# EasyEDA Pro project esp8266_for_led.eprj

# Schematic 懒人关灯
Board Name: Board1; Create Date: 2025-05-22; Page Name: P1; Project Name: esp8266_for_led; Schematic Name: 懒人关灯; Update Date: 2025-05-25; Company: 嘉立创EDA; Page Size: A4; Version: V1.0
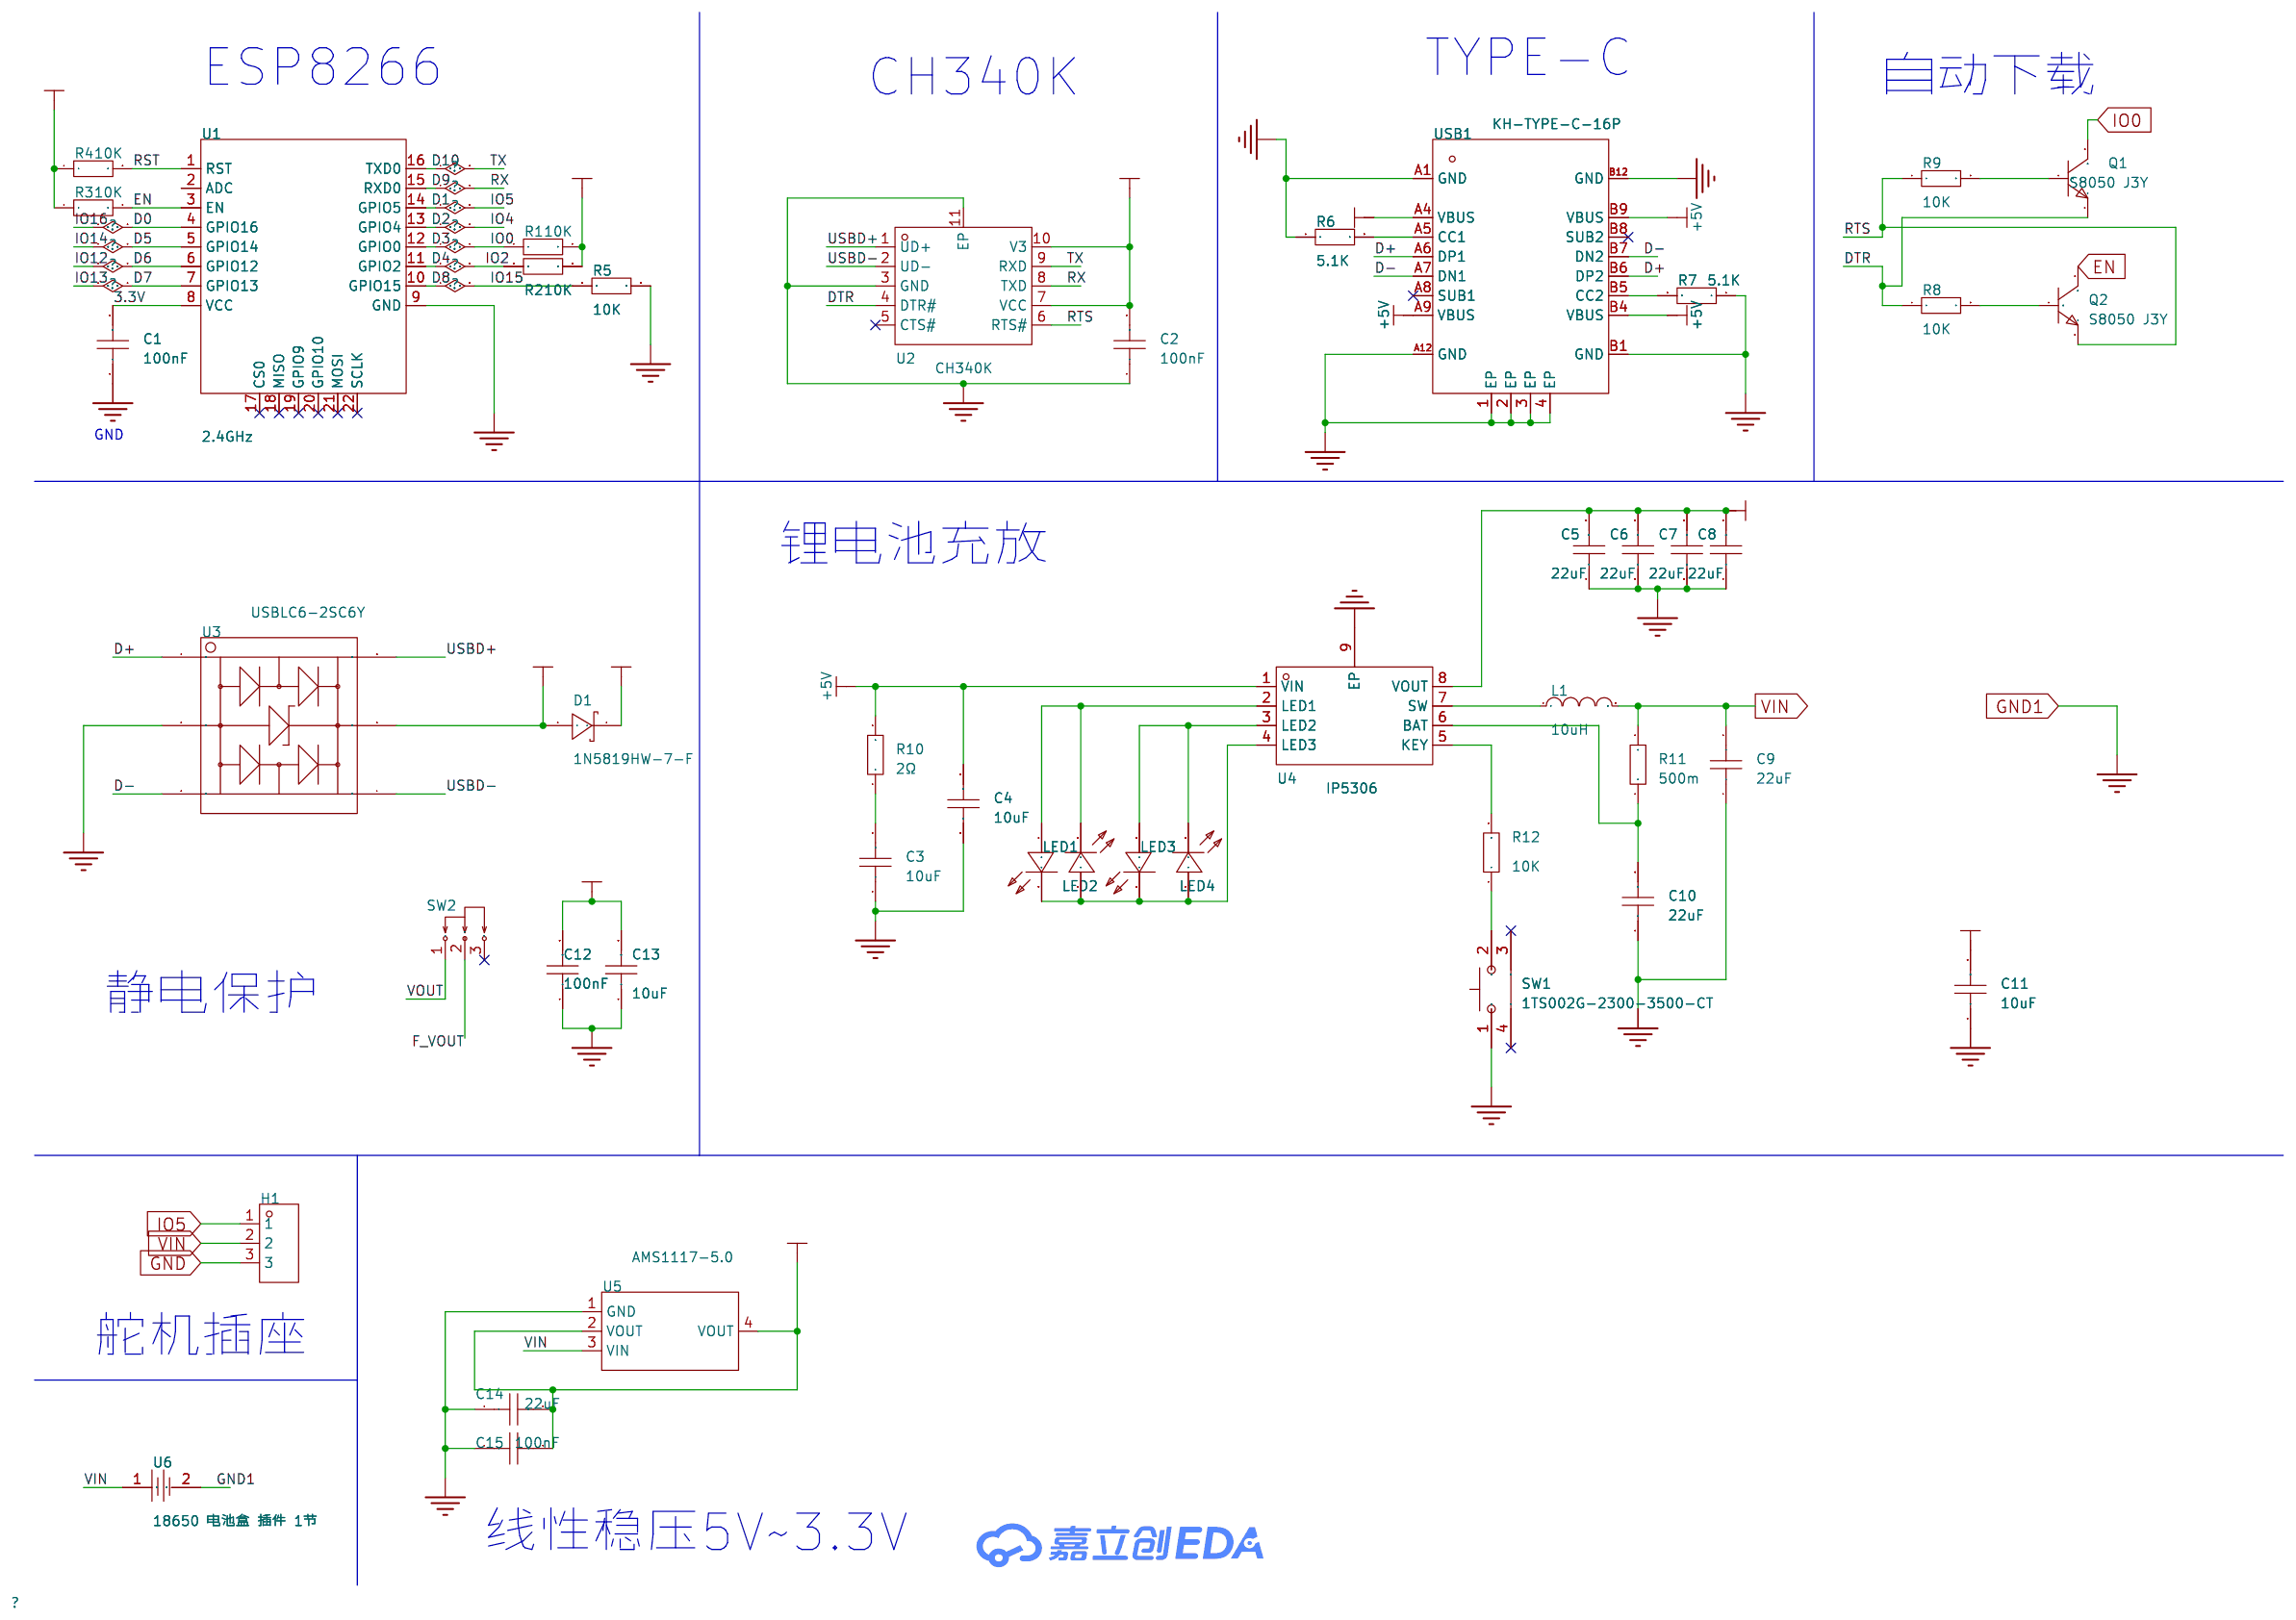
[diagram p0: schematic sheet]

## Parts
C1  100nF  [C0603]
C2  100nF  [C0603]
C3  10uF  [C0603]
C4  10uF  [C0603]
C5  22uF  [C0603]
C6  22uF  [C0603]
C7  22uF  [C0603]
C8  22uF  [C0603]
C9  22uF  [C0603]
C10  22uF  [C0603]
C11  10uF  [C0603]
C12  100nF  [C0603]
C13  10uF  [C0603]
C14  22uF  [C0603]
C15  100nF  [C0603]
D1  1N5819HW-7-F  [SOD-123_L2.7-W1.6-LS3.7-RD]
H1  PZ254V-11-03P-YL  [HDR-TH_PZ254V-11-03P-YL]
L1  10uH  [L0603]
LED1  KT-0805G  [LED0805-R-RD]
LED2  KT-0805G  [LED0805-R-RD]
LED3  KT-0805G  [LED0805-R-RD]
LED4  KT-0805G  [LED0805-R-RD]
Q1  S8050 J3Y  [SOT-23-3_L3.0-W1.7-P0.95-LS2.9-BR]
Q2  S8050 J3Y  [SOT-23-3_L3.0-W1.7-P0.95-LS2.9-BR]
R1  10K  [R0603]
R2  10K  [R0603]
R3  10K  [R0603]
R4  10K  [R0603]
R5  10K  [R0603]
R6  5.1K  [R0603]
R7  5.1K  [R0603]
R8  10K  [R0603]
R9  10K  [R0603]
R10  2Ω  [R0603]
R11  500m  [R0603]
R12  10K  [R0603]
SW1  1TS002G-2300-3500-CT  [KEY-SMD_1TS002G]
SW2  SS12D10G4 071  [SW-TH_SHOU-HAN_SS12D10G4]
U1  2.4GHz  [WIFIM-SMD_ESP-12F-ESP8266MOD]
U2  CH340K  [ESOP-10_L4.9-W3.9-P1.00-LS6.2-BL-EP]
U3  USBLC6-2SC6Y  [SOT-23-6_L2.9-W1.6-P0.95-LS2.8-BL]
U4  IP5306  [ESOP-8_L4.9-W3.9-P1.27-LS6.0-BL-EP]
U5  AMS1117-5.0  [SOT-223_L6.5-W3.5-P2.30-LS7.0-BR]
U6  18650 电池盒 插件 1节  [BAT-TH_18650-C9900004923]
USB1  KH-TYPE-C-16P  [USB-C-SMD_KH-TYPE-C-16P]

## Library data of the parts
C1-C15 = CAP_0603: Supplier Footprint: 0603
D1 = 1N5819HW-7-F: LCSC Part Name: 电压:40V 电流:1A; Supplier Part: C82544; Manufacturer: DIODES(美台); Supplier Footprint: SOD-123; JLCPCB Part Class: 扩展库; Datasheet: https://atta.szlcsc.com/upload/public/pdf/source/20161024/1477288459223.pdf; Supplier: LCSC; Forward Voltage (Vf@If): 450mV@1A; Reverse Voltage (Vr): 40V; Rectified Current: 1A; Reverse Leakage Current (Ir): 1mA@40V
H1 = PZ254V-11-03P-YL: Supplier Part: C41425306; Manufacturer: XFCN(兴飞); Supplier Footprint: 插件,P=2.54mm; JLCPCB Part Class: 扩展库; Datasheet: https://atta.szlcsc.com/upload/public/pdf/source/20241009/C227763597A5D58F5275B212435FDB0D.pdf; Supplier: LCSC
L1 = L_0603
LED1-LED4 = KT-0805G: LCSC Part Name: 0805 翠绿 高亮; Supplier Part: C2297; Manufacturer: KENTO; Supplier Footprint: 0805; JLCPCB Part Class: 基础库; Datasheet: https://atta.szlcsc.com/upload/public/pdf/source/20170209/1486607340485.pdf; Supplier: LCSC; Emitted Color: 翠绿色
Q1 Q2 = S8050 J3Y(RANGE:200-350): LCSC Part Name: H档(200-350); Supplier Part: C2146; Manufacturer: CJ(江苏长电/长晶); Supplier Footprint: SOT-23; JLCPCB Part Class: 基础库; Datasheet: https://atta.szlcsc.com/upload/public/pdf/source/20231013/FF37B6A000E6CDA75C9C999D2E78731F.pdf; Supplier: LCSC; type: NPN; Current - Collector(Ic): 500mA; Collector - Emitter Voltage VCEO: 25V; Pd - Power Dissipation: 300mW; DC Current Gain: 200@500mA,1V; Transition frequency(fT): 150MHz; Current - Collector Cutoff: 100nA; Vce Saturation(VCE(sat)): 600mV; Operating Temperature: -55℃~+150℃
R1-R12 = Res_0603: Supplier Footprint: 0603
SW1 = 1TS002G-2300-3500-CT: LCSC Part Name: 7.6*3.5*3.5mm 卧贴 轻触开关; Supplier Part: C319377; Manufacturer: HYP(鸿源精密); Supplier Footprint: SMD,3.5x7.6mm; JLCPCB Part Class: 扩展库; Datasheet: https://atta.szlcsc.com/upload/public/pdf/source/20181106/C319377_FDC1FB9730904BE1C6DB205F4DA5523F.pdf; Supplier: LCSC; Circuit: 单刀单掷; Actuator Style: 矩形按钮; Operating Force: 230gf; Mounting Style: 卧贴; Switch Length: 7.6mm; Switch Width: 3.5mm; Switch Height: 3.5mm; Strike Gundam: 不带; Contact Current: 50mA; Voltage Rating (DC): 12V; Power Rating: 0.6W; Insulation Resistance: 100MΩ; Actuator/Cap Color: 黑色; With Lamp: 无; Pin Style: J型引脚; Mechanical Life: 3万次; Operating Temperature: -40℃~+90℃
SW2 = SS12D10G4 071: Supplier Part: C2887259; Manufacturer: SHOU HAN(首韩); Supplier Footprint: 插件; JLCPCB Part Class: 扩展库; Datasheet: https://atta.szlcsc.com/upload/public/pdf/source/20210820/80D1704BBF3FCEE0435FCAA54C61E0A3.pdf; Supplier: LCSC; Circuit: 单刀双掷; Pin Style: PC引脚; Switch Length: 12.7mm; Switch Width: 6.7mm; Switch Height: 6.4mm; Mounting Style: 直插; Current Rating (DC): 2A; Voltage Rating (DC): 125V; Mechanical Life: 3千次; Operating Temperature: -16℃~+60℃
U1 = ESP-12F(ESP8266MOD): LCSC Part Name: 完整的802.11b/g/nWi-FiSoC模块 屏蔽罩上的丝印是：ESP8266MOD，ESP8266EX串口WIFI; Supplier Part: C82891; Manufacturer: Ai-Thinker(安信可); Supplier Footprint: SMD,16x24mm; JLCPCB Part Class: 扩展库; Datasheet: https://atta.szlcsc.com/upload/public/pdf/source/20210219/C82891_ABD84A460F4F056A2757267CCCA4B508.pdf; Supplier: LCSC; Core Processor: ESP8266芯片; Support Interface: GPIO；UART；I2C；PWM；SPI；ADC; Antenna Type: 板载PCB天线; Output Power: 16dBm; Operating Voltage: 3.3V; Receive  Current: 120mA; Send  Current: 170mA; Sensitivity: -90dBm; Operating Temperature: -40℃~+85℃
U2 = CH340K: LCSC Part Name: USB转串口芯片CH340; Supplier Part: C968586; Manufacturer: WCH(南京沁恒); Supplier Footprint: ESSOP-10-150mil-1mm; JLCPCB Part Class: 扩展库; Datasheet: https://atta.szlcsc.com/upload/public/pdf/source/20240313/C21A12AB66F63ABF8F8743FF13A35C95.pdf; Supplier: LCSC; Applications Function: USB转串口; Protocol: USB 2.0; Voltage - Supply: 3.3V；5V; Data Rate: 2Mbps; Operating Temperature: -20℃~+70℃
U3 = USBLC6-2SC6Y: Supplier Part: C5310974; Manufacturer: TECH PUBLIC(台舟); Supplier Footprint: SOT-23-6; JLCPCB Part Class: 扩展库; Datasheet: https://atta.szlcsc.com/upload/public/pdf/source/20221212/069345D45678B0F27086425C11086B50.pdf; Supplier: LCSC
U4 = IP5306: Supplier Part: C181692; Manufacturer: INJOINIC(英集芯); Supplier Footprint: ESOP-8; JLCPCB Part Class: 扩展库; Datasheet: https://atta.szlcsc.com/upload/public/pdf/source/20190627/C384572_9925B3DDC4041BC6108E5AB46A2A0AB1.pdf; Supplier: LCSC
U5 = AMS1117-5.0_C6187: LCSC Part Name: 输入12V 输出5V 1A; Supplier Part: C6187; Manufacturer: AMS; Supplier Footprint: SOT-223; JLCPCB Part Class: 基础库; Datasheet: https://atta.szlcsc.com/upload/public/pdf/source/20230918/E4B716057EE82179D88E8A0894830D59.pdf; Supplier: LCSC; Output Type: 固定; Voltage - Supply: 12V; Output Voltage: 5V; Output Current: 1A; Voltage Dropout: 1.3V@(1A); Features: 过流保护(OCP); Output Configuration: 正极; Number of Outputs: 1
U6 = 18650 电池盒 插件 1节: Supplier Part: C9900004923; Supplier Footprint: BAT_TH_2P-L77.7-W20.9-P55.61; JLCPCB Part Class: 扩展库; Supplier: LCSC
USB1 = KH-TYPE-C-16P: LCSC Part Name: Type-C 母 卧贴; Supplier Part: C709357; Manufacturer: kinghelm(金航标); Supplier Footprint: SMD; JLCPCB Part Class: 扩展库; Datasheet: https://atta.szlcsc.com/upload/public/pdf/source/20200911/C709357_AA8DCEB38BB20E3035A7ED7AE7667837.pdf; Supplier: LCSC; Connector Type: Type-C; Gender: 母; Number of Ports: 1; Number of Contacts: 16P; Mounting Style: 卧贴; Current Rating - Power (Max): 3A; Operating Temperature Range: -40℃~+85℃

## Nets
3.3V: C1.2 U1.8(VCC)
+3.3V: C2.2 C14.2 C15.2 R1.2 R2.2 R3.1 R4.1 U2.7(VCC) U2.10(V3) U5.2(VOUT) U5.4(VOUT)
+5V: C4.2 R10.2 U4.1(VIN) USB1.A4(VBUS) USB1.A9(VBUS) USB1.B4(VBUS) USB1.B9(VBUS)
GND: C1.1 C2.1 C3.1 C4.1 C5.1 C6.1 C7.1 C8.1 C9.1 C10.1 C11.1 C12.1 C13.1 C14.1 C15.1 H1.3 R5.2 R6.1 R7.1 SW1.1 U1.9(GND) U2.3(GND) U2.11(EP) U3.2(GND) U4.9(EP) U5.1(GND) USB1.1(EP) USB1.2(EP) USB1.3(EP) USB1.4(EP) USB1.A1(GND) USB1.A12(GND) USB1.B1(GND) USB1.B12(GND)
GND1: U6.2
VIN: C9.2 C11.2 D1.1(K) H1.2 L1.2 R11.2 U5.3(VIN) U6.1
D0: U1.4(GPIO16)
D1: H1.1 U1.14(GPIO5)
D2: U1.13(GPIO4)
D3: Q1.3(C) R1.1 U1.12(GPIO0)
D4: R2.1 U1.11(GPIO2)
D5: U1.5(GPIO14)
D6: U1.6(GPIO12)
D7: U1.7(GPIO13)
D8: R5.1 U1.10(GPIO15)
D9: U1.15(RXD0) U2.8(TXD)
D10: U1.16(TXD0) U2.9(RXD)
D+: U3.1(I/O1) USB1.A6(DP1) USB1.B6(DP2)
D-: U3.3(I/O2) USB1.A7(DN1) USB1.B7(DN2)
DTR: Q1.2(E) R8.1 U2.4(DTR#)
EN: Q2.3(C) R3.2 U1.3(EN)
F_VOUT: C12.2 C13.2 D1.2(A) SW2.2 U3.5(VBUS)
RST: R4.2 U1.1(RST)
RTS: Q2.2(E) R9.1 U2.6(RTS#)
USBD+: U2.1(UD+) U3.6(I/O1)
USBD-: U2.2(UD-) U3.4(I/O2)
VOUT: C5.2 C6.2 C7.2 C8.2 SW2.1 U4.8(VOUT)
$1N1979: R6.2 USB1.A5(CC1)
$1N2301: R7.2 USB1.B5(CC2)
$1N2667: Q1.1(B) R9.2
$1N2978: Q2.1(B) R8.2
$1N3700: C3.2 R10.1
$1N4027: LED1.1(A) LED2.2(K) U4.2(LED1)
$1N4045: LED3.1(A) LED4.2(K) U4.3(LED2)
$1N4060: LED1.2(K) LED2.1(A) LED3.2(K) LED4.1(A) U4.4(LED3)
$1N4374: L1.1 U4.7(SW)
$1N4651: C10.2 R11.1 U4.6(BAT)
$1N4760: R12.2 U4.5(KEY)
$1N4967: R12.1 SW1.2

Not connected (* = marked no-connect by the designer): SW1 3* 4*; SW2 3*; U1 2(ADC) 17(CS0)* 18(MISO)* 19(GPIO9)* 20(GPIO10)* 21(MOSI)* 22(SCLK)*; U2 5(CTS#)*; USB1 A8(SUB1)* B8(SUB2)*

## Notes on the sheet
- ESP8266
- TYPE-C
- CH340K
- 自动下载
- GND
- 锂电池充放
- 静电保护
- 舵机插座
- 线性稳压5V~3.3V

# Board PCB1
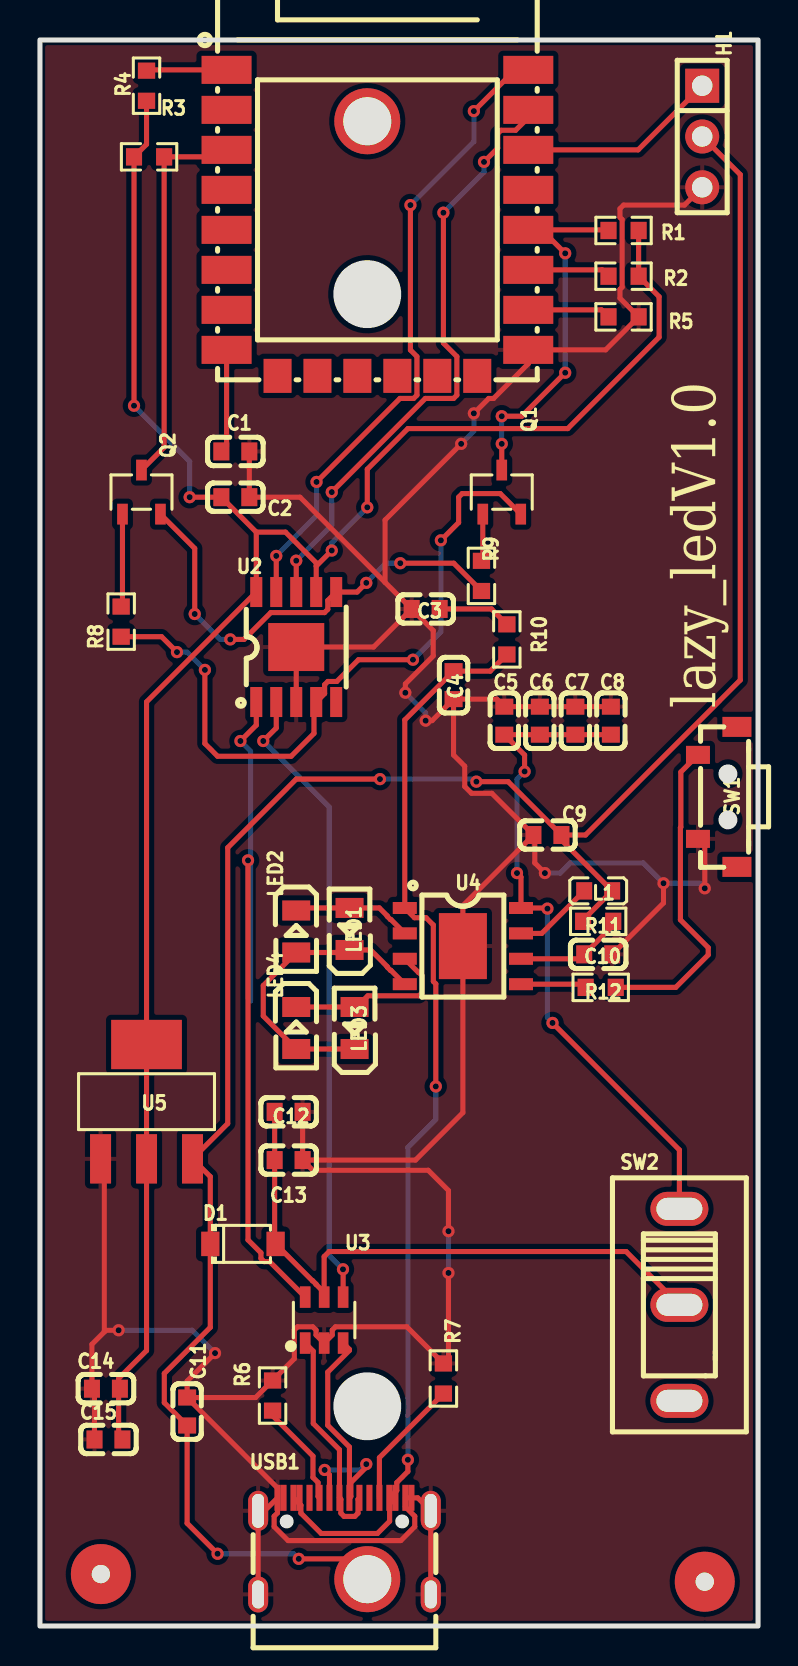
[diagram p1: board, top side]
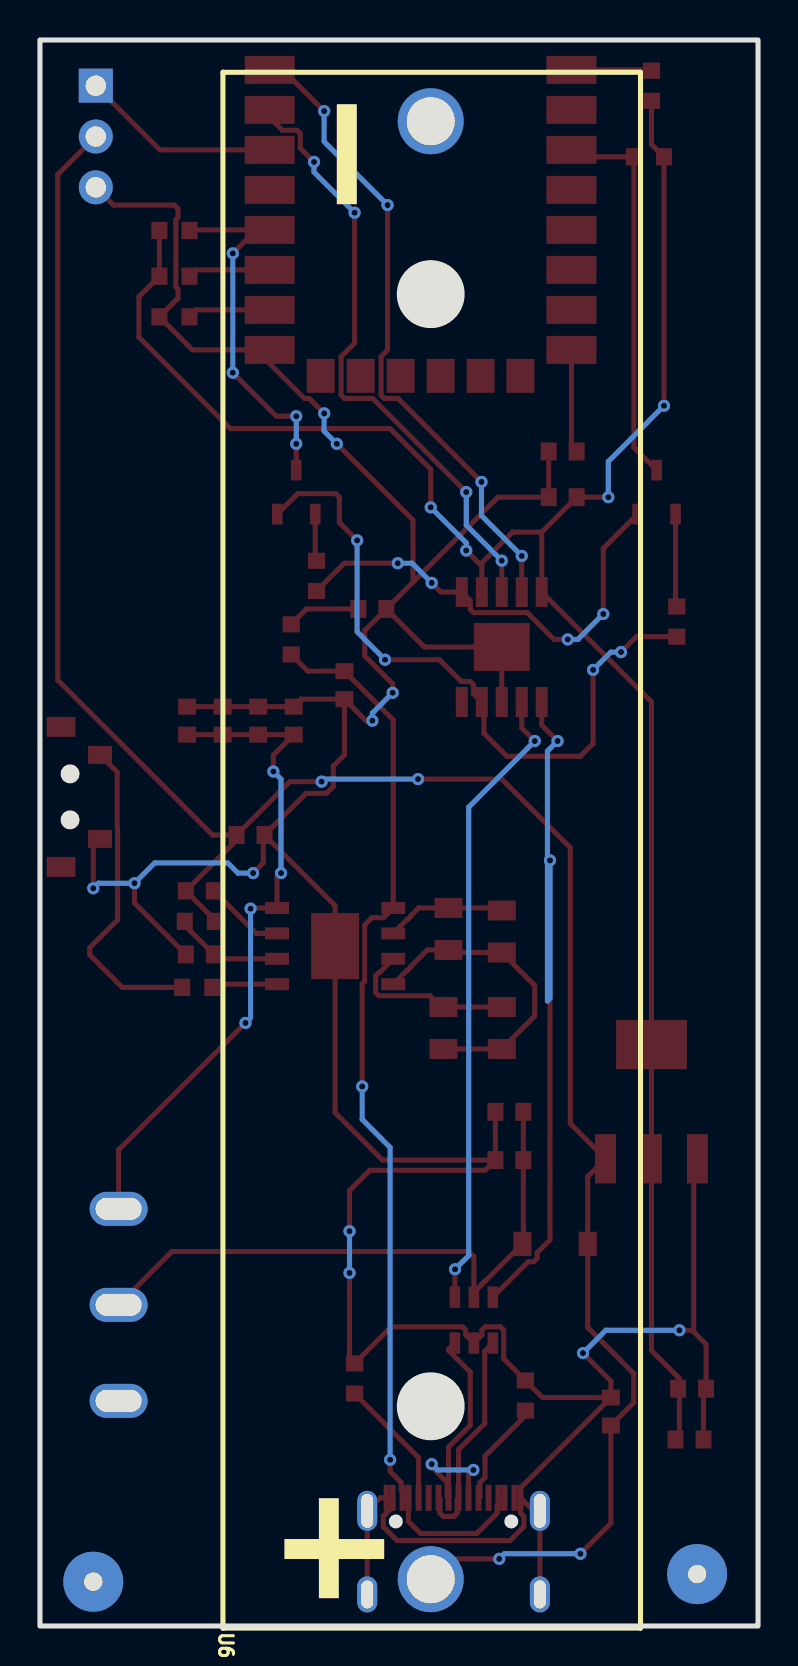
[diagram p2: board, bottom side, seen from below]

Outline 35.94 x 79.3 mm; copper layers: Top Layer, Bottom Layer. Coordinates in mm from the lower left corner of the outline.
Outline path: rectangle 0,79.3 35.94,0
Stack: Top Layer 0.035mm / Dielectric1 1.51mm FR4 er 4.5 / Bottom Layer 0.035mm

## Design rules (mm)
template: JLCPCB Capability(Two Layers Board)
spacing copperThickness1oz (default): track to track 0.102, other pairs 0.152 to 0.3
spacing copperThickness2oz: track to track 0.203, other pairs 0.152 to 0.3
track width copperThickness1oz (default): min 0.127, default 0.254, max 2.54
track width copperThickness2oz: min 0.203, default 0.254, max 2.54
differential pair differentialPair (default): width min 0.127, default 0.254, max 2.54; gap min 0.152, default 0.152
via viaSize (default): diameter min 0.5, default 0.61, max 10; hole min 0.3, default 0.305, max 6.3

## Placement (name value [footprint] x y rotation side)
C1  100nF  [C0603]  9.78 58.73 180 top
C2  100nF  [C0603]  9.78 56.44 180 top
C3  10uF  [C0603]  19.3 50.86 0 top
C4  10uF  [C0603]  20.7 47.05 90 top
C5  22uF  [C0603]  23.24 45.27 270 top
C6  22uF  [C0603]  25.02 45.27 270 top
C7  22uF  [C0603]  26.8 45.27 270 top
C8  22uF  [C0603]  28.57 45.27 270 top
C9  22uF  [C0603]  25.4 39.55 0 top
C10  22uF  [C0603]  27.94 33.58 180 top
C11  10uF  [C0603]  7.37 10.72 270 top
C12  100nF  [C0603]  12.45 25.71 180 top
C13  10uF  [C0603]  12.45 23.3 180 top
C14  22uF  [C0603]  3.3 11.87 0 top
C15  100nF  [C0603]  3.43 9.33 0 top
D1  1N5819HW-7-F  [SOD-123_L2.7-W1.6-LS3.7-RD]  10.16 19.11 0 top
H1  PZ254V-11-03P-YL  [HDR-TH_PZ254V-11-03P-YL]  33.15 74.48 270 top
L1  10uH  [L0603]  27.94 36.76 0 top
LED1  KT-0805G  [LED0805-R-RD]  15.49 34.85 90 top
LED2  KT-0805G  [LED0805-R-RD]  12.83 34.73 270 top
LED3  KT-0805G  [LED0805-R-RD]  15.75 29.9 90 top
LED4  KT-0805G  [LED0805-R-RD]  12.83 29.9 270 top
NOREF  -  [Pad_e45]  33.27 2.22 0 top
NOREF#2  -  [Pad_e47]  3.05 2.6 0 top
Q1  S8050 J3Y  [SOT-23-3_L3.0-W1.7-P0.95-LS2.9-BR]  23.11 56.7 270 top
Q2  S8050 J3Y  [SOT-23-3_L3.0-W1.7-P0.95-LS2.9-BR]  5.08 56.7 270 top
R1  10K  [R0603]  29.21 69.78 0 top
R2  10K  [R0603]  29.21 67.49 0 top
R3  10K  [R0603]  5.46 73.46 0 top
R4  10K  [R0603]  5.33 77.02 90 top
R5  10K  [R0603]  29.21 65.46 0 top
R6  5.1K  [R0603]  11.64 11.52 270 top
R7  5.1K  [R0603]  20.19 12.38 270 top
R8  10K  [R0603]  4.06 50.22 90 top
R9  10K  [R0603]  22.1 52.51 90 top
R10  2Ω  [R0603]  23.37 49.33 270 top
R11  500m  [R0603]  27.94 35.23 180 top
R12  10K  [R0603]  28.07 31.93 180 top
SW1  1TS002G-2300-3500-CT  [KEY-SMD_1TS002G]  33.91 41.46 90 top
SW2  SS12D10G4 071  [SW-TH_SHOU-HAN_SS12D10G4]  32 16.06 270 top
U1  2.4GHz  [WIFIM-SMD_ESP-12F-ESP8266MOD]  16.89 70.16 270 top
U2  CH340K  [ESOP-10_L4.9-W3.9-P1.00-LS6.2-BL-EP]  12.83 48.95 0 top
U3  USBLC6-2SC6Y  [SOT-23-6_L2.9-W1.6-P0.95-LS2.8-BL]  14.22 15.3 0 top
U4  IP5306  [ESOP-8_L4.9-W3.9-P1.27-LS6.0-BL-EP]  21.17 34 270 top
U5  AMS1117-5.0  [SOT-223_L6.5-W3.5-P2.30-LS7.0-BR]  5.33 26.22 270 top
U6  18650 电池盒 插件 1节  [BAT-TH_18650-C9900004923]  16.38 38.79 90 bottom
USB1  KH-TYPE-C-16P  [USB-C-SMD_KH-TYPE-C-16P]  15.24 3.99 0 top

## Footprints (pads in the part's own frame, mm; a bottom-side part is the same pattern mirrored in y, then rotated)
BAT-TH_18650-C9900004923
  round 3.3 hole 2.4: 1(-36.45,0) 2(36.45,0)
C0603
  rect 0.8x0.9 smd: 1(-0.7,0) 2(0.7,0)
ESOP-8_L4.9-W3.9-P1.27-LS6.0-BL-EP
  rect 0.6x1.2 smd: 1(-1.905,-2.909) 2(-0.635,-2.909) 3(0.635,-2.909) 4(1.905,-2.909) 5(1.905,2.909) 6(0.635,2.909) 7(-0.635,2.909) 8(-1.905,2.909)
  rect 3.3x2.4 smd: 9(0,0)
ESOP-10_L4.9-W3.9-P1.00-LS6.2-BL-EP
  rect 0.6x1.5 smd: 1(-2,-2.75) 2(-1,-2.75) 3(0,-2.75) 4(1,-2.75) 5(2,-2.75) 6(2,2.75) 7(1,2.75) 8(0,2.75) 9(-1,2.75) 10(-2,2.75)
  rect 2.8x2.4 smd: 11(0,0)
HDR-TH_PZ254V-11-03P-YL
  rect 1.7x1.7 hole 1.02: 1(-2.54,0)
  round 1.7 hole 1.02: 2(0,0) 3(2.54,0)
KEY-SMD_1TS002G
  rect 0.9x1.2 smd: 1(-2.1,0.975) 2(2.1,0.975)
  rect 1x1.45 smd: 3(3.5,-0.975) 4(-3.5,-0.975)
L0603
  rect 0.8x0.864 smd: 1(-0.7,0) 2(0.7,0)
LED0805-R-RD
  rect 1x1.399 smd: 1(1.05,0) 2(-1.05,0)
Pad_e45
  round 3 hole 0.914: 1(0,0)
Pad_e47
  round 3 hole 0.914: 1(0,0)
R0603
  rect 0.806x0.864 smd: 1(-0.753,0) 2(0.753,0)
SOD-123_L2.7-W1.6-LS3.7-RD
  rect 0.91x1.22 smd: 1(-1.635,0) 2(1.635,0)
SOT-23-3_L3.0-W1.7-P0.95-LS2.9-BR
  rect 1.038x0.532 smd: 1(1.101,-0.95) 2(1.101,0.95) 3(-1.101,0)
SOT-23-6_L2.9-W1.6-P0.95-LS2.8-BL
  rect 0.532x1.072 smd: 1(-0.95,-1.149) 2(0,-1.149) 3(0.95,-1.149) 4(0.95,1.149) 5(0,1.149) 6(-0.95,1.149)
SOT-223_L6.5-W3.5-P2.30-LS7.0-BR
  rect 2.465x1.05 smd: 1(2.857,-2.3) 2(2.857,0) 3(2.857,2.3)
  rect 2.465x3.54 smd: 4(-2.857,0)
SW-TH_SHOU-HAN_SS12D10G4
  oval 1.7x2.9 hole 1.1x2.3: 1(-4.8,0) 2(0,0) 3(4.8,0)
USB-C-SMD_KH-TYPE-C-16P
  oval 1x2 hole 0.6x1.7: 1(-4.32,1.765) 2(4.32,1.765)
  oval 1x1.8 hole 0.6x1.4: 3(-4.32,-2.415) 4(4.32,-2.415)
  rect 0.3x1.3 smd: A1(-3.35,2.415) A4(-2.55,2.415) A5(-1.25,2.415) A6(-0.25,2.415) A7(0.25,2.415) A8(1.25,2.415) A9(2.55,2.415) A12(3.35,2.415) B1(3.05,2.415) B4(2.25,2.415) B5(1.75,2.415) B6(0.75,2.415) B7(-0.75,2.415) B8(-1.75,2.415) B9(-2.25,2.415) B12(-3.05,2.415)
WIFIM-SMD_ESP-12F-ESP8266MOD
  rect 1.4x2.5 smd: 1(-7.651,-7.551) 2(-5.651,-7.551) 3(-3.651,-7.551) 4(-1.651,-7.551) 5(0.349,-7.551) 6(2.349,-7.551) 7(4.349,-7.551) 8(6.349,-7.551) 9(6.349,7.548) 10(4.349,7.55) 11(2.349,7.551) 12(0.349,7.551) 13(-1.651,7.55) 14(-3.651,7.551) 15(-5.651,7.551) 16(-7.651,7.551)
  rect 1.7x1.4 smd: 17(7.651,-5) 18(7.649,-3.002) 19(7.649,-1.004) 20(7.649,0.998) 21(7.649,2.997) 22(7.651,4.997)

## Nets
As in the schematic.

Pads without a net: NOREF 1; NOREF#2 1; SW1 3 4; SW2 3; U1 2 17 18 19 20 21 22; U2 5; USB1 A8 B8

## Via types
v1: diameter 0.61, hole 0.305, Top Layer to Bottom Layer, 51 vias

## Routing (per net, layer and track width the routed paths; a pad name or vN(x,y) marks a point on that pad's centre or on a via; arc(x,y) is an arc through that point)
3.3V: length 5.2
  Top Layer w0.254: C1.2 9.34,58.99 U1.8
+3.3V: length 107.7
  Top Layer w0.254: v1(7.49,56.44) C2.2 10.83,54.7 ; 10.83,54.7 U2.10 5.33,46.21 U5.4 U5.2 5.33,13.77 3.94,12.38 3.94,9.52 C15.2 ; 10.83,54.7 12.29,54.7 13.83,53.16 13.83,53 ; U2.7 13.83,53 ; 13.83,53 v1(14.6,53.78) ; v1(16.38,55.94) 16.38,57.84 18.41,59.87 26.42,59.87 30.99,64.45 30.99,66.47 R2.2 R1.2 ; R4.1 5.33,74.09 R3.1 v1(4.71,61.02)
  Bottom Layer w0.254: v1(14.6,53.78) 14.6,54.16 v1(16.38,55.94) ; v1(4.71,61.02) 7.49,58.23 v1(7.49,56.44)
+5V: length 54.6
  Top Layer w0.254: 17.79,6.41 17.5,6.12 17.5,5.24 16.89,4.63 14.08,4.63 13.06,5.64 13.06,6.04 12.69,6.41 ; v1(19.81,26.98) 19.81,32.11 19.69,32.23 19.69,35.05 19.33,35.41 18.75,35.41 U4.1 18.26,45.31 C4.2 22.54,47.75 R10.2 ; 17.49,6.41 17.86,6.78 17.86,7.17 18.41,7.73 v1(18.41,8.31)
  Bottom Layer w0.254: v1(19.81,26.98) 19.81,25.33 18.41,23.93 v1(18.41,8.31)
GND: length 209.9
  Top Layer w0.254: C3.1 16.7,48.95 U2.11 U2.3 ; C3.1 19.69,49.78 19.69,48.51 18.29,47.11 v1(18.29,46.67) ; C3.1 17.27,52.19 ; v1(33.27,36.89) 33.27,39.02 SW1.1 ; 10.48,58.73 10.48,56.44 13.02,56.44 17.27,52.19 ; U5.1 3.22,23.18 3.22,14.7 ; v1(20.45,17.65) 20.45,13.38 R7.1 18.36,14.96 14.79,14.96 14.63,14.8 14.63,14.55 U3.2 13.82,14.55 13.82,14.8 13.66,14.96 12.89,14.96 12.73,14.8 12.73,13.36 R6.1 10.79,11.42 7.37,11.42 ; v1(20.45,19.74) 20.45,21.77 19.43,22.79 13.65,22.79 C13.1 ; 11.89,6.41 11.89,6.9 7.37,11.42 ; 11.89,6.41 11.24,5.76 USB1.1 USB1.3 ; 11.89,6.41 11.89,5.66 11.72,5.49 11.72,4.97 12.42,4.27 18.06,4.27 18.76,4.97 18.76,5.49 18.29,5.96 18.29,6.41 18.91,6.41 USB1.2 USB1.4 ; C9.1 24.76,39.49 24.76,38.16 v1(25.27,37.65) ; C9.1 21.17,36.02 U4.9 21.17,25.67 18.8,23.3 C13.1 ; C9.1 22.62,41.64 21.6,41.64 21.26,41.98 21.26,42.99 20.7,43.55 C4.1 ; v1(21.08,59.11) 17.27,55.3 17.27,52.19 ; v1(8.76,13.64) 7.37,12.25 7.37,11.42 ; C13.1 C12.1 ; C4.1 22.86,46.35 C5.1 C6.1 C7.1 C8.1 ; C4.1 19.62,45.27 v1(19.3,45.27) ; C10.1 31.21,36.15 v1(31.21,37.14) ; H1.3 32.26,71.05 29.21,71.05 29.03,70.87 29.03,70.44 29.14,70.33 29.14,66.95 29.03,66.84 29.03,66.39 R5.2 28.31,63.81 U1.9 24.44,63.12 22.7,61.38 22.46,61.38 v1(21.72,60.64) ; 3.22,14.7 2.6,14.09 C14.1 2.73,11.74 C15.1 ; 3.22,14.7 3.3,14.79 v1(3.94,14.79)
  Bottom Layer w0.254: v1(18.29,46.67) 19.3,45.65 v1(19.3,45.27) ; v1(21.72,60.64) 21.72,59.75 v1(21.08,59.11) ; v1(8.76,13.64) 7.62,14.79 v1(3.94,14.79) ; v1(20.45,19.74) v1(20.45,17.65) ; v1(33.27,36.89) 33.02,37.14 v1(31.21,37.14) 30.19,38.16 26.54,38.16 26.03,37.65 v1(25.27,37.65)
VIN: length 111.5
  Top Layer w0.254: R11.2 27.19,35.31 L1.2 26.1,39.3 C9.2 ; v1(8.89,3.61) 7.37,5.14 C11.2 6.22,11.17 6.22,12.63 8.53,14.93 D1.1 8.53,22.47 U5.3 9.4,25.12 9.4,38.92 12.83,42.35 v1(17.02,42.35) ; H1.2 35.05,72.57 35.05,47.3 27.31,39.55 C9.2 ; v1(12.95,3.36) 16.25,3.36 16.38,3.23 ; C9.2 23.43,42.22 v1(21.84,42.22)
  Bottom Layer w0.254: v1(17.02,42.35) 21.72,42.35 v1(21.84,42.22) ; v1(8.89,3.61) 12.7,3.61 v1(12.95,3.36)
D1: length 10
  Top Layer w0.254: 33.15,77.02 29.94,73.81 U1.14
D3: length 18.4
  Top Layer w0.254: v1(26.29,68.64) 25.11,69.81 ; 25.11,69.81 28.43,69.81 R1.1 ; 25.11,69.81 U1.12 ; Q1.3 v1(23.11,59.11) ; v1(23.11,60.49) 24.11,60.49 v1(26.29,62.67)
  Bottom Layer w0.254: v1(26.29,62.67) v1(26.29,68.64) ; v1(23.11,59.11) v1(23.11,60.49)
D4: length 4.1
  Top Layer w0.254: R2.1 28.14,67.81 U1.11
D8: length 4.2
  Top Layer w0.254: R5.1 28.11,65.81 U1.10
D9: length 30.7
  Top Layer w0.254: v1(22.22,73.21) 22.91,73.9 22.91,74.63 23.08,74.79 23.81,74.79 24.44,75.42 U1.15 ; v1(14.6,56.7) 19.29,61.38 20.7,61.38 20.87,61.55 20.87,63.48 20.19,64.15 v1(20.19,70.67) ; v1(12.83,53.27) U2.8
  Bottom Layer w0.254: v1(14.6,56.7) 14.6,55.05 v1(12.83,53.27) ; v1(20.19,70.67) 22.22,72.7 v1(22.22,73.21)
D10: length 32.4
  Top Layer w0.254: U1.16 23.78,77.81 v1(21.72,75.75) ; U2.9 v1(11.83,53.51) ; v1(18.54,71.05) 18.54,63.8 18.87,63.48 18.87,61.55 18.7,61.38 18.02,61.38 v1(13.84,57.21)
  Bottom Layer w0.254: v1(21.72,75.75) 21.72,74.22 v1(18.54,71.05) ; v1(11.83,53.51) 13.84,55.52 v1(13.84,57.21)
D+: length 11
  Top Layer w0.254: U3.1 13.68,13.74 13.68,10.13 14.99,8.81 14.99,6.41 15.06,6.34 15.06,5.64 15.22,5.48 15.76,5.48 15.92,5.64 15.92,6.34 15.99,6.41
D-: length 14.5
  Top Layer w0.254: U3.3 15.49,13.83 15.49,13.78 14.4,12.7 14.4,10.04 15.49,8.95 15.49,6.41 15.56,6.48 15.56,7.17 16.33,7.95 v1(16.33,8.09) ; 14.49,6.41 14.49,7.56 v1(14.25,7.8)
  Bottom Layer w0.254: v1(16.33,8.09) 16.04,7.8 v1(14.25,7.8)
DTR: length 35
  Top Layer w0.254: v1(8.25,47.81) 8.25,44.12 8.89,43.49 12.57,43.49 13.72,44.63 13.72,46.09 U2.4 14.25,46.62 14.25,47.07 14.41,47.23 14.86,47.23 15.94,48.32 v1(18.67,48.32) ; v1(20.07,54.28) 20.96,55.17 20.96,56.44 21.13,56.62 23.04,56.62 Q1.2 ; v1(6.86,48.7) 6.09,49.47 R8.1
  Bottom Layer w0.254: v1(20.07,54.28) 20.07,49.71 v1(18.67,48.32) ; v1(8.25,47.81) 7.37,48.7 v1(6.86,48.7)
EN: length 19.4
  Top Layer w0.254: Q2.3 6.21,58.93 R3.2 8.99,73.46 U1.3
F_VOUT: length 31.1
  Top Layer w0.254: SW2.2 29.34,18.73 14.48,18.73 14.22,18.47 14.22,16.68 ; 14.22,16.68 13.82,17.08 13.82,17.1 13.66,17.26 13.64,17.26 D1.2 11.75,19.16 C13.2 C12.2 ; 14.22,16.68 U3.5
RST: length 4
  Top Layer w0.254: U1.1 5.37,77.81 R4.2
RTS: length 23
  Top Layer w0.254: v1(18.03,53.14) 20.71,53.14 R9.1 ; v1(16.33,52.16) 15.87,51.7 U2.6 14.41,51.28 14.41,50.84 14.24,50.67 11.55,50.67 10.21,49.33 v1(9.53,49.33) ; Q2.2 7.75,53.88 v1(7.75,50.6)
  Bottom Layer w0.254: v1(18.03,53.14) 17.32,53.14 v1(16.33,52.16) ; v1(7.75,50.6) 9.02,49.33 v1(9.53,49.33)
USBD+: length 45.8
  Top Layer w0.254: U2.1 10.83,45.05 v1(10.03,44.25) ; v1(10.41,38.28) 10.41,19.31 11.06,18.66 11.06,18.38 11.22,18.22 11.5,18.22 U3.6
  Bottom Layer w0.254: v1(10.03,44.25) 10.54,43.74 10.54,31.25 10.41,31.38 v1(10.41,38.28)
USBD-: length 31.7
  Top Layer w0.254: v1(11.18,44.25) 11.83,44.9 U2.2 ; U3.4 15.17,17.83 v1(15.17,17.84)
  Bottom Layer w0.254: v1(15.17,17.84) 14.48,18.53 14.48,40.95 v1(11.18,44.25)
VOUT: length 33.7
  Top Layer w0.254: v1(23.88,37.65) 24.08,37.45 U4.8 25.37,35.9 v1(25.4,35.87) ; v1(25.65,30.16) 32,23.81 SW2.1 ; v1(24.26,42.73) 24.26,43.55 C5.2 C6.2 C7.2 C8.2
  Bottom Layer w0.254: v1(24.26,42.73) 23.88,42.35 v1(23.88,37.65) ; v1(25.65,30.16) 25.4,30.41 v1(25.4,35.87)
$1N1979: length 5.3
  Top Layer w0.254: R6.2 11.64,10.52 13.66,8.49 13.66,7.43 13.92,7.17 13.92,6.48 13.99,6.41
$1N2301: length 6.5
  Top Layer w0.254: 16.99,6.41 16.99,8.42 R7.2
$1N2667: length 2.4
  Top Layer w0.254: Q1.1 22.16,53.33 R9.2
$1N2978: length 4.6
  Top Layer w0.254: R8.2 4.13,51.04 Q2.1
$1N3700: length 3.7
  Top Layer w0.254: C3.2 22.6,50.86 R10.1
$1N4027: length 6
  Top Layer w0.254: LED2.2 12.95,35.9 LED1.1 16.99,35.9 17.38,35.51 17.38,35.49 17.54,35.32 17.57,35.32 U4.2
$1N4045: length 8.7
  Top Layer w0.254: U4.3 18.95,32.67 18.98,32.67 19.14,32.51 19.14,31.68 18.98,31.51 16.41,31.51 15.85,30.95 LED3.1 LED4.2
$1N4060: length 15.3
  Top Layer w0.254: LED3.2 LED4.1 11.18,30.5 11.18,32.03 LED2.1 15.37,33.68 LED1.2 16.55,33.8 17.38,32.97 17.38,32.95 17.54,32.78 17.57,32.78 U4.4
$1N4374: length 4
  Top Layer w0.254: L1.1 25.11,34.63 U4.7
$1N4651: length 5.5
  Top Layer w0.254: U4.6 27.02,33.36 C10.2 28.69,35.04 R11.1
$1N4760: length 3.3
  Top Layer w0.254: U4.5 27.15,32.09 R12.2
$1N4967: length 16.2
  Top Layer w0.254: R12.1 31.82,31.93 33.45,33.56 33.45,33.92 32.06,35.31 32.06,39.92 32.08,39.95 32.08,42.7 SW1.2

## Copper pours and planes (outline as drawn; the poured copper is in the pictures)
GND on Top Layer: 0,79.3 35.94,79.3 35.94,0 0,0

## Text on the board
Top Silkscreen Layer: lazy_ledV1.0
